# EAGLE design interface 2k20 (EAGLE 9.5.1)

## Sheet 1 of 3
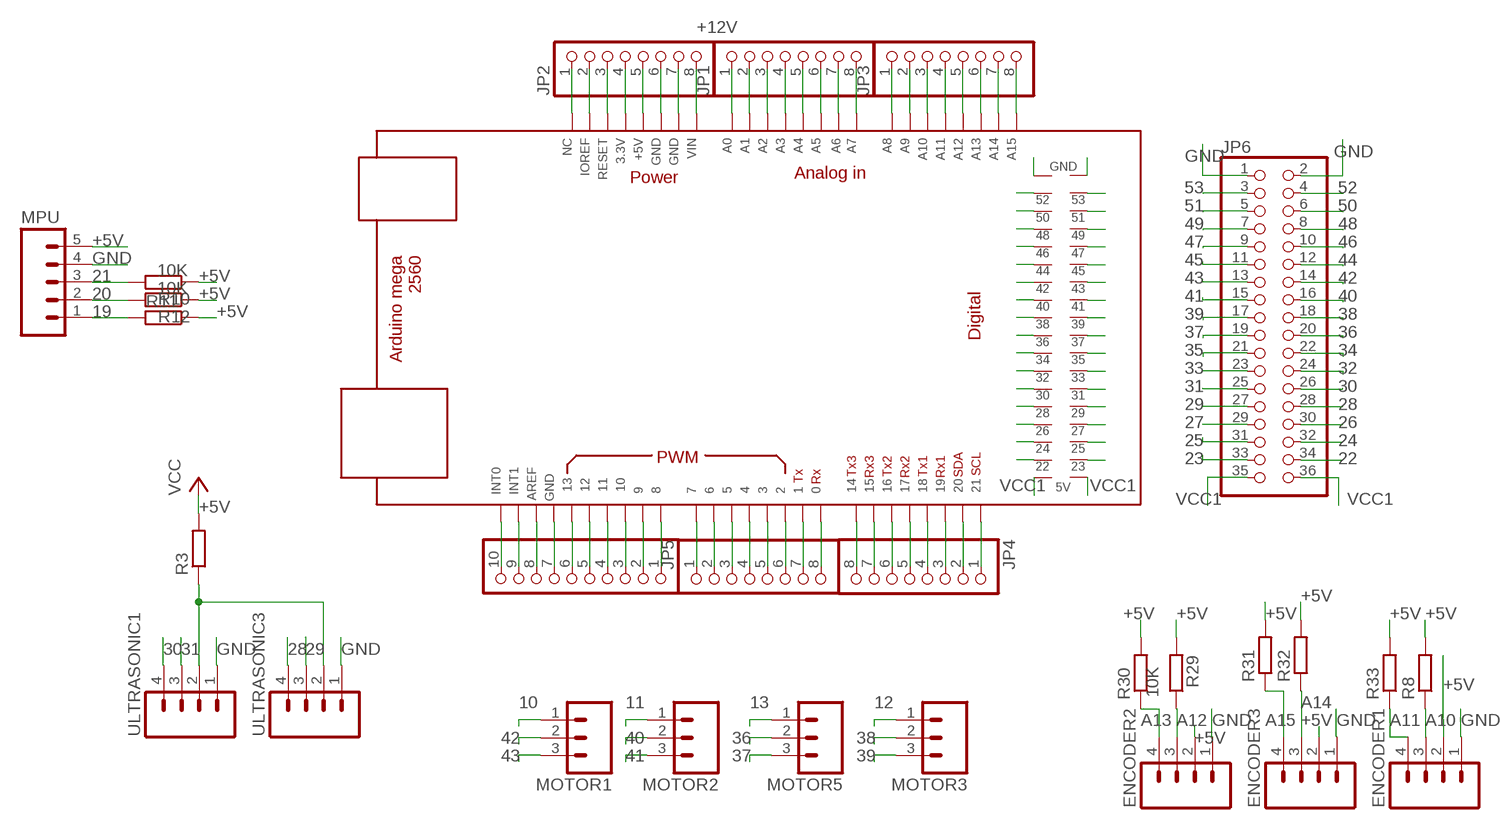
[diagram p0: schematic, sheet 1]

### Parts
ENCODER1  ULTRASONIC  M04POLAR  [MOLEX-1X4]
ENCODER2  ULTRASONIC  M04POLAR  [MOLEX-1X4]
ENCODER3  ULTRASONIC  M04POLAR  [MOLEX-1X4]
JP1  PINHD-1X8  [1X08]
JP2  PINHD-1X8  [1X08]
JP3  PINHD-1X8  [1X08]
JP4  PINHD-1X8  [1X08]
JP5  PINHD-1X8  [1X08]
JP6  PINHD-2X18  [2X18]
MOTOR1  M03POLAR  [MOLEX-1X3@1]
MOTOR2  M03POLAR  [MOLEX-1X3@1]
MOTOR3  M03POLAR  [MOLEX-1X3@1]
MOTOR5  M03POLAR  [MOLEX-1X3@1]
MPU  M05  [05P]
PWMH1  pwm  PINHD-1X10_ARD  [1X10]
R3  R-EU_M0805  [M0805]
R8  R-EU_M0805  [M0805]
R10  10K  R-EU_M0805  [M0805]
R11  R-EU_M0805  [M0805]
R12  10K  R-EU_M0805  [M0805]
R29  R-EU_M0805  [M0805]
R30  10K  R-EU_M0805  [M0805]
R31  R-EU_M0805  [M0805]
R32  R-EU_M0805  [M0805]
R33  R-EU_M0805  [M0805]
U$1  MEGA_DEVICE  [MEGABOX]
ULTRASONIC1  ULTRASONIC  M04POLAR  [MOLEX-1X4]
ULTRASONIC3  ULTRASONIC  M04POLAR  [MOLEX-1X4]

### Nets
0: JP5.8 U$1.0
1: JP5.7 U$1.1
2: JP5.6 U$1.2
3: JP5.5 U$1.3
3.3V: JP2.4 U$1.3V3
4: JP5.4 U$1.4
5: JP5.3 U$1.5
6: JP5.2 U$1.6
7: JP5.1 U$1.7
8: PWMH1.1 U$1.8
9: PWMH1.2 U$1.9
10: MOTOR1.1 PWMH1.3 U$1.10
11: MOTOR2.1 PWMH1.4 U$1.11
12: MOTOR3.1 PWMH1.5 U$1.12
13: MOTOR5.1 PWMH1.6 U$1.13
14: JP4.8 U$1.14
15: JP4.7 U$1.15
16: JP4.6 U$1.16
17: JP4.5 U$1.17
18: JP4.4 U$1.18
19: JP4.3 MPU.1 R11.2 U$1.19
20: JP4.2 MPU.2 R12.2 U$1.20
21: JP4.1 MPU.3 R10.2 U$1.21
22: JP6.34 U$1.22 ; also sheet 3
23: JP6.33 U$1.23 ; also sheet 3
24: JP6.32 U$1.24 ; also sheet 2
25: JP6.31 U$1.25 ; also sheet 2
26: JP6.30 U$1.26
27: JP6.29 U$1.27
28: JP6.28 U$1.28 ULTRASONIC3.4
29: JP6.27 U$1.29 ULTRASONIC3.3
30: JP6.26 U$1.30 ULTRASONIC1.4
31: JP6.25 U$1.31 ULTRASONIC1.3
32: JP6.24 U$1.32
33: JP6.23 U$1.33
34: JP6.22 U$1.34
35: JP6.21 U$1.35
36: JP6.20 MOTOR5.2 U$1.36
37: JP6.19 MOTOR5.3 U$1.37
38: JP6.18 MOTOR3.2 U$1.38
39: JP6.17 MOTOR3.3 U$1.39
40: JP6.16 MOTOR2.2 U$1.40
41: JP6.15 MOTOR2.3 U$1.41
42: JP6.14 MOTOR1.2 U$1.42
43: JP6.13 MOTOR1.3 U$1.43
44: JP6.12 U$1.44
45: JP6.11 U$1.45 ; also sheet 3
46: JP6.10 U$1.46 ; also sheet 3
47: JP6.9 U$1.47 ; also sheet 3
48: JP6.8 U$1.48 ; also sheet 3
49: JP6.7 U$1.49 ; also sheet 3
50: JP6.6 U$1.50 ; also sheet 2
51: JP6.5 U$1.51 ; also sheet 2
52: JP6.4 U$1.52 ; also sheet 2
53: JP6.3 U$1.53 ; also sheet 2
+5V: ENCODER1.2 ENCODER2.2 ENCODER3.2 MPU.5 R3.2 R8.2 R10.1 R11.1 R12.1 R29.2 R30.2 R31.2 R32.2 R33.2 ; supply symbol labelled VCC ; also sheet 2,3
+12V: JP2.8 U$1.VIN ; also sheet 2
A0: JP1.1 U$1.A0
A1: JP1.2 U$1.A1
A2: JP1.3 U$1.A2
A3: JP1.4 U$1.A3
A4: JP1.5 U$1.A4
A5: JP1.6 U$1.A5
A6: JP1.7 U$1.A6
A7: JP1.8 U$1.A7
A8: JP3.1 U$1.A8
A9: JP3.2 U$1.A9
A10: ENCODER1.3 JP3.3 R8.1 U$1.A10
A11: ENCODER1.4 JP3.4 R33.1 U$1.A11
A12: ENCODER2.3 JP3.5 R29.1 U$1.A12
A13: ENCODER2.4 JP3.6 R30.1 U$1.A13
A14: ENCODER3.3 JP3.7 R32.1 U$1.A14
A15: ENCODER3.4 JP3.8 R31.1 U$1.A15
AREF: PWMH1.8 U$1.AREF
GND: ENCODER1.1 ENCODER2.1 ENCODER3.1 JP2.6 JP2.7 JP6.1 JP6.2 MPU.4 PWMH1.7 U$1.GND@1(GND) U$1.GND@2(GND) U$1.GND@3(GND) U$1.GND@4(GND) U$1.GND@5(GND) ULTRASONIC1.1 ULTRASONIC3.1 ; also sheet 2,3
INT0: PWMH1.10 U$1.INT2
INT1: PWMH1.9 U$1.INT1
IOREF: JP2.2 U$1.IOREF
N$27: R3.1 ULTRASONIC1.2 ULTRASONIC3.2
NC: JP2.1 U$1.NC
RESET: JP2.3 U$1.RESET ; also sheet 3
VCC: JP2.5 U$1.5V ; also sheet 2
VCC1: JP6.35 JP6.36 U$1.5V@1(5V) U$1.5V@2(5V)

## Sheet 2 of 3
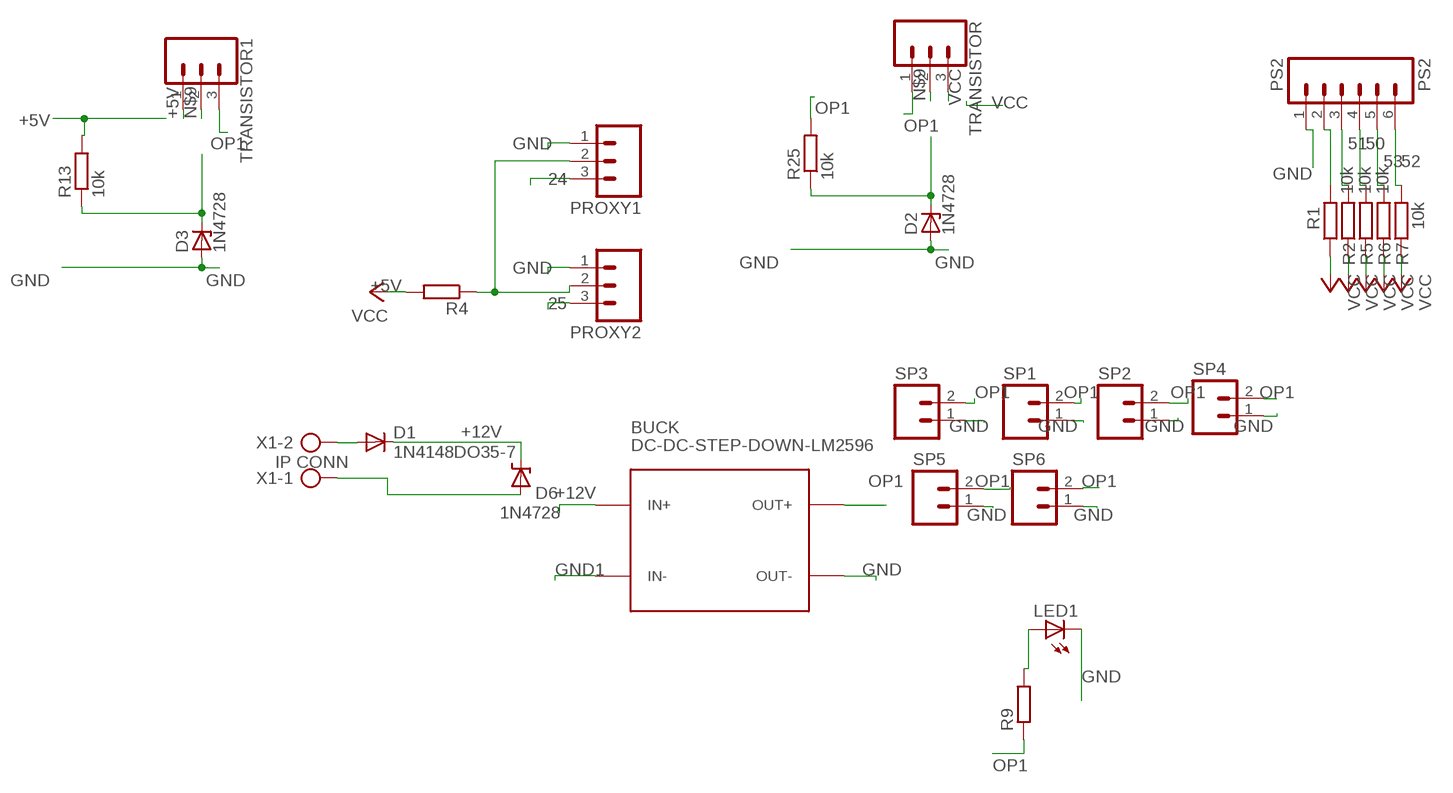
[diagram p1: schematic, sheet 2]

### Parts
BUCK  DC-DC-STEP-DOWN-LM2596  [DC-DC-STEP-DOWN-LM2596]
D1  1N4148DO35-7  [DO35-7]
D2  1N4728  [DO41Z10]
D3  1N4728  [DO41Z10]
D6  1N4728  [DO41Z10]
LED1  LEDCHIPLED_0805  [CHIPLED_0805]
PROXY1  M03POLAR  [MOLEX-1X3@1]
PROXY2  M03POLAR  [MOLEX-1X3@1]
PS2  PS2  M06POLAR  [MOLEX-1X6]
R1  R-EU_M0805  [M0805]
R2  10k  R-EU_M0805  [M0805]
R4  R-EU_M0805  [M0805]
R5  10k  R-EU_M0805  [M0805]
R6  10k  R-EU_M0805  [M0805]
R7  10k  R-EU_M0805  [M0805]
R9  500  R-EU_M0805  [M0805]
R13  10k  R-EU_M0805  [M0805]
R25  10k  R-EU_M0805  [M0805]
SP1  M02  [02P]
SP2  M02  [02P]
SP3  M02  [02P]
SP4  M02  [02P]
SP5  M02  [02P]
SP6  M02  [02P]
TRANSISTOR  CONN_03LOCK  [1X03_LOCK]
TRANSISTOR1  CONN_03LOCK  [1X03_LOCK]
X1  IP CONN  AK300/2  [AK300/2]

### Nets
24: PROXY1.3 ; also sheet 1
25: PROXY2.3 ; also sheet 1
50: PS2.4 R5.2 ; also sheet 1
51: PS2.3 R2.2 ; also sheet 1
52: PS2.6 R7.2 ; also sheet 1
53: PS2.5 R6.2 ; also sheet 1
+5V: R1.1 R2.1 R4.2 R5.1 R6.1 R7.1 R13.2 TRANSISTOR1.1 ; supply symbol labelled VCC ; also sheet 1,3
+12V: BUCK.IN+ D1.C D6.C ; also sheet 1
GND: BUCK.OUT- D2.A D3.A LED1.C PROXY1.1 PROXY2.1 PS2.1 SP1.1 SP2.1 SP3.1 SP4.1 SP5.1 SP6.1 ; also sheet 1,3
GND1: BUCK.IN- D6.A X1.1
N$1: LED1.A R9.2
N$3: D1.A X1.2
N$8: PROXY1.2 PROXY2.2 R4.1
N$9: D2.C D3.C R13.1 R25.1 TRANSISTOR1.2 TRANSISTOR.2
N$28: PS2.2 R1.2
OP1: BUCK.OUT+ R9.1 R25.2 SP1.2 SP2.2 SP3.2 SP4.2 SP5.2 SP6.2 TRANSISTOR1.3 TRANSISTOR.1
VCC: TRANSISTOR.3 ; also sheet 1

## Sheet 3 of 3
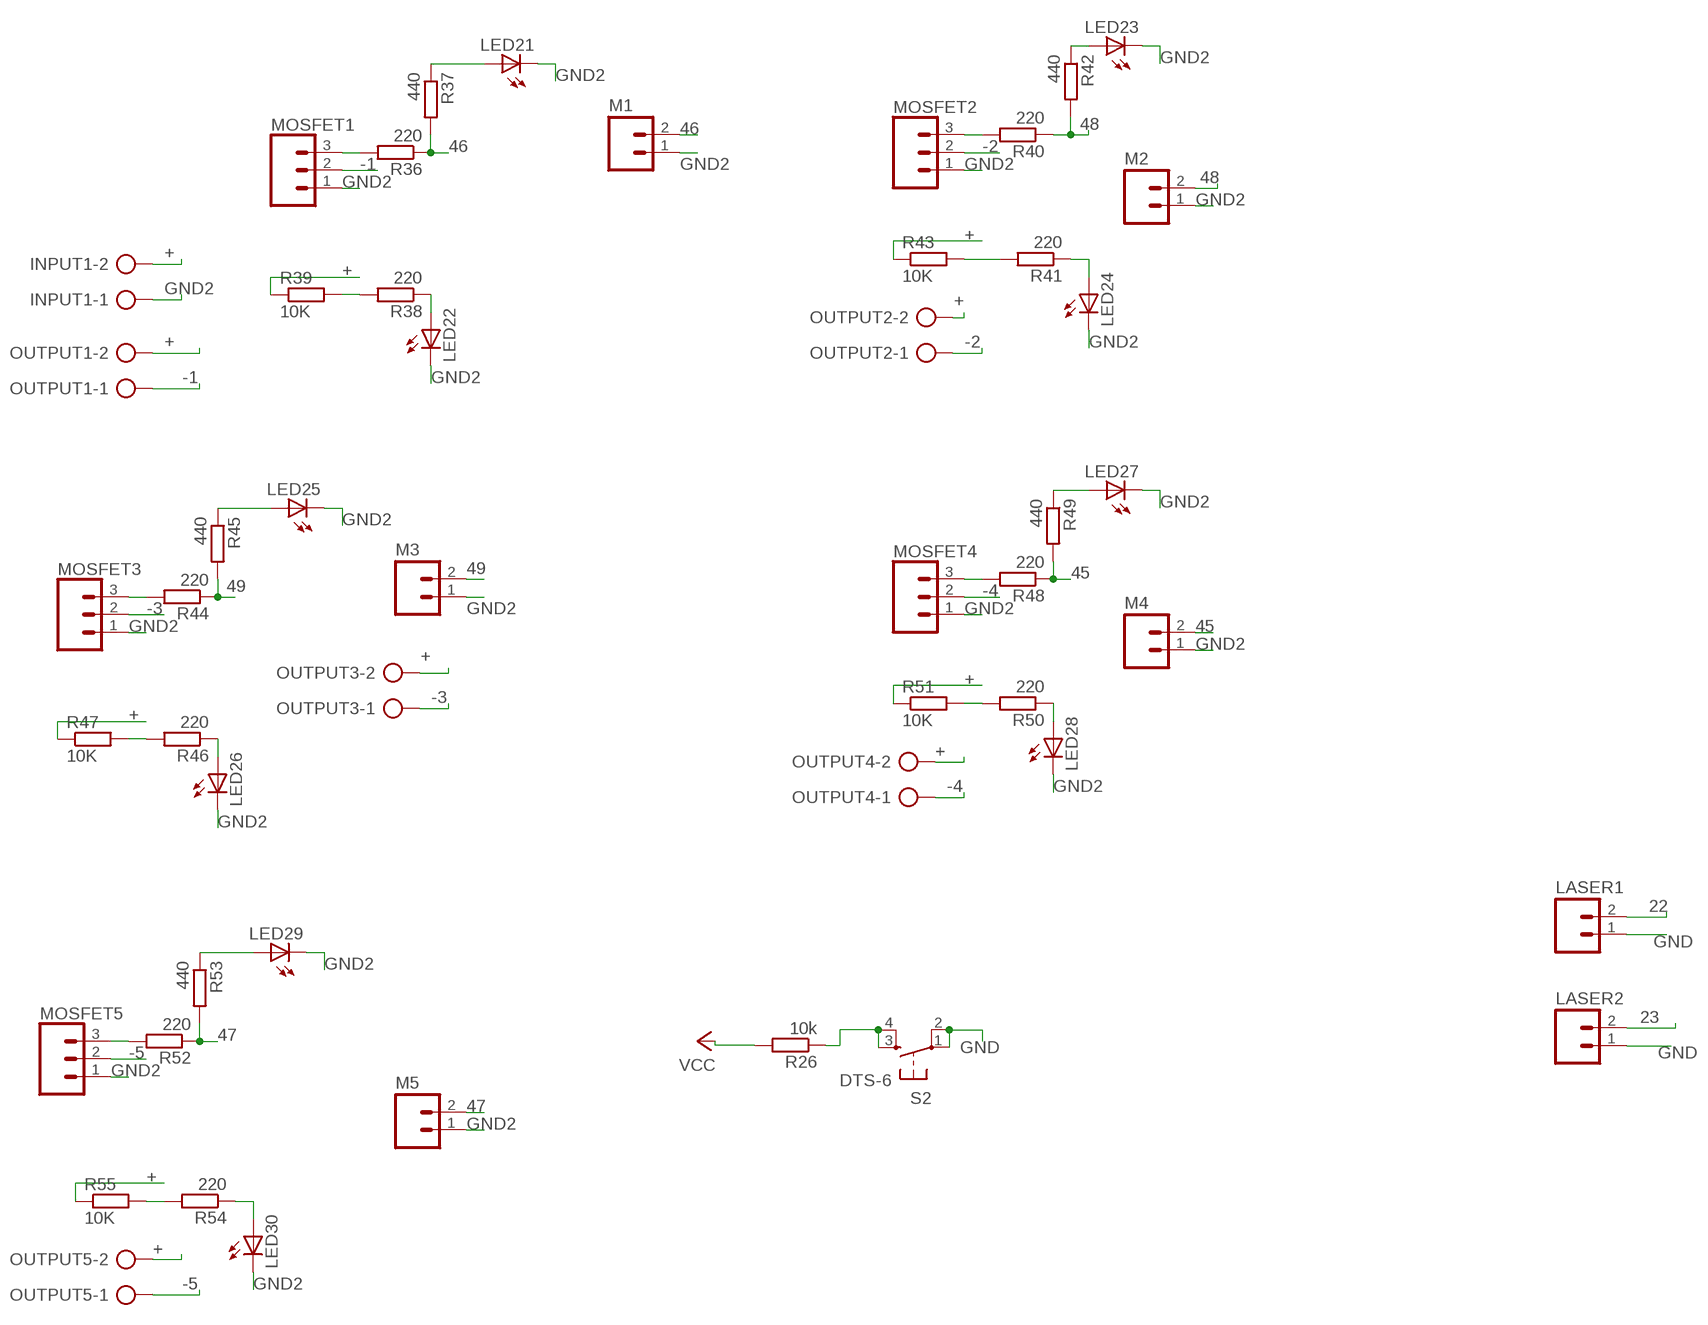
[diagram p2: schematic, sheet 3]

### Parts
INPUT1  AK300/2  [AK300/2]
LASER1  M02  [02P]
LASER2  M02  [02P]
LED21  LEDCHIPLED_0805  [CHIPLED_0805]
LED22  LEDCHIPLED_0805  [CHIPLED_0805]
LED23  LEDCHIPLED_0805  [CHIPLED_0805]
LED24  LEDCHIPLED_0805  [CHIPLED_0805]
LED25  LEDCHIPLED_0805  [CHIPLED_0805]
LED26  LEDCHIPLED_0805  [CHIPLED_0805]
LED27  LEDCHIPLED_0805  [CHIPLED_0805]
LED28  LEDCHIPLED_0805  [CHIPLED_0805]
LED29  LEDCHIPLED_0805  [CHIPLED_0805]
LED30  LEDCHIPLED_0805  [CHIPLED_0805]
M1  M02  [02P]
M2  M02  [02P]
M3  M02  [02P]
M4  M02  [02P]
M5  M02  [02P]
MOSFET1  CONN_03LOCK  [1X03_LOCK]
MOSFET2  CONN_03LOCK  [1X03_LOCK]
MOSFET3  CONN_03LOCK  [1X03_LOCK]
MOSFET4  CONN_03LOCK  [1X03_LOCK]
MOSFET5  CONN_03LOCK  [1X03_LOCK]
OUTPUT1  AK300/2  [AK300/2]
OUTPUT2  AK300/2  [AK300/2]
OUTPUT3  AK300/2  [AK300/2]
OUTPUT4  AK300/2  [AK300/2]
OUTPUT5  AK300/2  [AK300/2]
R26  10k  R-EU_M0805  [M0805]
R36  220  R-EU_M0805  [M0805]
R37  440  R-EU_M0805  [M0805]
R38  220  R-EU_M0805  [M0805]
R39  10K  R-EU_R0805  [R0805]
R40  220  R-EU_M0805  [M0805]
R41  220  R-EU_M0805  [M0805]
R42  440  R-EU_M0805  [M0805]
R43  10K  R-EU_R0805  [R0805]
R44  220  R-EU_M0805  [M0805]
R45  440  R-EU_M0805  [M0805]
R46  220  R-EU_M0805  [M0805]
R47  10K  R-EU_R0805  [R0805]
R48  220  R-EU_M0805  [M0805]
R49  440  R-EU_M0805  [M0805]
R50  220  R-EU_M0805  [M0805]
R51  10K  R-EU_R0805  [R0805]
R52  220  R-EU_M0805  [M0805]
R53  440  R-EU_M0805  [M0805]
R54  220  R-EU_M0805  [M0805]
R55  10K  R-EU_R0805  [R0805]
S2  DTS-6  [DTS-6]

### Nets
22: LASER1.2 ; also sheet 1
23: LASER2.2 ; also sheet 1
45: M4.2 R48.1 R49.2 ; also sheet 1
46: M1.2 R36.1 R37.2 ; also sheet 1
47: M5.2 R52.1 R53.2 ; also sheet 1
48: M2.2 R40.1 R42.2 ; also sheet 1
49: M3.2 R44.1 R45.2 ; also sheet 1
+: INPUT1.2 OUTPUT1.2 OUTPUT2.2 OUTPUT3.2 OUTPUT4.2 OUTPUT5.2 R39.1 R43.1 R47.1 R51.1 R55.1
+5V: R26.2 ; supply symbol labelled VCC ; also sheet 1,2
-1: MOSFET1.2 OUTPUT1.1
-2: MOSFET2.2 OUTPUT2.1
-3: MOSFET3.2 OUTPUT3.1
-4: MOSFET4.2 OUTPUT4.1
-5: MOSFET5.2 OUTPUT5.1
GND: LASER1.1 LASER2.1 S2.1 S2.2 ; also sheet 1,2
GND2: INPUT1.1 LED21.C LED22.C LED23.C LED24.C LED25.C LED26.C LED27.C LED28.C LED29.C LED30.C M1.1 M2.1 M3.1 M4.1 M5.1 MOSFET1.1 MOSFET2.1 MOSFET3.1 MOSFET4.1 MOSFET5.1
N$41: MOSFET1.3 R36.2
N$42: LED21.A R37.1
N$43: LED22.A R38.1
N$44: R38.2 R39.2
N$45: MOSFET2.3 R40.2
N$46: LED23.A R42.1
N$47: R41.2 R43.2
N$48: LED24.A R41.1
N$49: MOSFET3.3 R44.2
N$50: LED25.A R45.1
N$51: LED26.A R46.1
N$52: R46.2 R47.2
N$53: MOSFET4.3 R48.2
N$54: LED27.A R49.1
N$55: LED28.A R50.1
N$56: R50.2 R51.2
N$57: LED29.A R53.1
N$58: MOSFET5.3 R52.2
N$59: R54.2 R55.2
N$60: LED30.A R54.1
RESET: R26.1 S2.3 S2.4 ; also sheet 1

## Library data of the parts
BUCK = diy-modules:DC-DC-STEP-DOWN-LM2596: DC/DC Step-Down Regulator based on LM2596-ADJ chip LM2596 datasheet available here: http://www.ti.com/lit/ds/symlink/lm2596.pdf Click here to find device on ebay.com <http://www.ebay.com/sch/lm2596+power+regulator>
D1 = diode:1N4148: DIODE high speed (Philips)
D2 D3 D6 = diode:1N4728: Z DIODE 3.3 V, 1W, 5 percent
ENCODER1-ENCODER3 ULTRASONIC1 ULTRASONIC3 = SparkFun-Connectors:M04: Header 4 Standard 4-pin 0.1" header. Use with straight break away headers (SKU : PRT-00116), right angle break away headers (PRT-00553), swiss pins (PRT-00743), machine pins (PRT-00117), and female headers (PRT-00115). Molex polarized connector foot print use with SKU : PRT-08231 with associated crimp pins and housings. 1MM SMD Version SKU: PRT-10208
INPUT1 OUTPUT2-OUTPUT5 X1 = con-ptr500:AK300/2: CONNECTOR; OC_FARNELL: unknown; OC_NEWARK: unknown
JP1-JP5 = pinhead:PINHD-1X8: PIN HEADER
JP6 = pinhead:PINHD-2X18: PIN HEADER
LASER1 LASER2 M1-M5 SP1-SP6 = con-amp-quick:M02: AMP QUICK CONNECTOR; OC_FARNELL: unknown; OC_NEWARK: unknown
LED1 LED21-LED30 = led:LED: LED OSRAM: - CHIPLED LG R971, LG N971, LY N971, LG Q971, LY Q971, LO R971, LY R971 LH N974, LH R974 LS Q976, LO Q976, LY Q976 LO Q996 - Hyper CHIPLED LW Q18S LB Q993, LB Q99A, LB R99A - SideLED LS A670, LO A670, LY A670, LG A670, LP A670 LB A673, LV A673, LT A673, LW A673 LH A674 LY A675 LS A676, LA A676, LO A676, LY A676, LW A676 LS A679, LY A679, LG A679 - Hyper Micro SIDELED® LS Y876, LA Y876, LO Y876, LY Y876 LT Y87S - SmartLED LW L88C, LW L88S LB L89C, LB L89S, LG L890 LS L89K, LO L89K, LY L89K LS L896, LA L896, LO L896, LY L896 - TOPLED LS T670, LO T670, LY T670, LG T670, LP T670 LSG T670, LSP T670, LSY T670, LOP T670, LYG T670 LG T671, LOG T671, LSG T671 LB T673, LV T673, LT T673, LW T673 LH T674 LS T676, LA T676, LO T676, LY T676, LB T676, LH T676, LSB T676, LW T676 LB T67C, LV T67C, LT T67C, LS T67K, LO T67K, LY T67K, LW E67C LS E67B, LA E67B, LO E67B, LY E67B, LB E67C, LV E67C, LT E67C LW T67C LS T679, LY T679, LG T679 LS T770, LO T770, LY T770, LG T770, LP T770 LB T773, LV T773, LT T773, LW T773 LH T774 LS E675, LA E675, LY E675, LS T675 LS T776, LA T776, LO T776, LY T776, LB T776 LHGB T686 LT T68C, LB T68C - Hyper Mini TOPLED® LB M676 - Mini TOPLED Santana® LG M470 LS M47K, LO M47K, LY M47K Source: http://www.osram.convergy.de LUXEON: - LUMILED® LXK2-PW12-R00, LXK2-PW12-S00, LXK2-PW14-U00, LXK2-PW14-V00 LXK2-PM12-R00, LXK2-PM12-S00, LXK2-PM14-U00 LXK2-PE12-Q00, LXK2-PE12-R00, LXK2-PE12-S00, LXK2-PE14-T00, LXK2-PE14-U00 LXK2-PB12-K00, LXK2-PB12-L00, LXK2-PB12-M00, LXK2-PB14-N00, LXK2-PB14-P00, LXK2-PB14-Q00 LXK2-PR12-L00, LXK2-PR12-M00, LXK2-PR14-Q00, LXK2-PR14-R00 LXK2-PD12-Q00, LXK2-PD12-R00, LXK2-PD12-S00 LXK2-PH12-R00, LXK2-PH12-S00 LXK2-PL12-P00, LXK2-PL12-Q00, LXK2-PL12-R00 Source: www.luxeon.com KINGBRIGHT: KA-3528ASYC Source: www.kingbright.com
MOSFET1-MOSFET5 TRANSISTOR TRANSISTOR1 = SparkFun-Connectors:CONN_03: Multi connection point. Often used as Generic Header-pin footprint for 0.1 inch spaced/style header connections On any of the 0.1 inch spaced packages, you can populate with these: Break Away Headers - Straight <https://www.sparkfun.com/products/116> (PRT-00116) Break Away Male Headers - Right Angle <https://www.sparkfun.com/products/553> (PRT-00553) Female Headers <https://www.sparkfun.com/products/115> (PRT-00115) Break Away Headers - Machine Pin <https://www.sparkfun.com/products/117> (PRT-00117) Break Away Female Headers - Swiss Machine Pin <https://www.sparkfun.com/products/743> (PRT-00743) Stackable Header - 3 Pin (Female, 0.1") <https://www.sparkfun.com/products/13875> (PRT-13875) For SCREWTERMINALS and SPRING TERMINALS visit here: Screw Terimnals on SparkFun.com <https://www.sparkfun.com/search/results?term=Screw+Terminals> (5mm/3.5mm/2.54mm spacing) This device is also useful as a general connection point to wire up your design to another part of your project. Our various solder wires solder well into these plated through hole pads. Hook-Up Wire - Assortment (Stranded, 22 AWG) <https://www.sparkfun.com/products/11375> (PRT-11375) Hook-Up Wire - Assortment (Solid Core, 22 AWG) <https://www.sparkfun.com/products/11367> (PRT-11367) View the entire wire category on our website here <https://www.sparkfun.com/categories/141> Special notes: Molex polarized connector foot print use with SKU : PRT-08232 with associated crimp pins and housings.
MOTOR1-MOTOR3 MOTOR5 PROXY1 PROXY2 = SparkFun-Connectors:M03: Header 3 Standard 3-pin 0.1" header. Use with straight break away headers (SKU : PRT-00116), right angle break away headers (PRT-00553), swiss pins (PRT-00743), machine pins (PRT-00117), and female headers (PRT-00115). Molex polarized connector foot print use with SKU : PRT-08232 with associated crimp pins and housings.
MPU = con-amp-quick:M05: AMP QUICK CONNECTOR; OC_FARNELL: unknown; OC_NEWARK: unknown
OUTPUT1 = con-ptr500:AK300/2: CONNECTOR; OC_FARNELL: unknown; OC_NEWARK: unknown; SPICEPREFIX: X
PS2 = SparkFun-Connectors:M06: Header 6 Standard 6-pin 0.1" header. Use with straight break away headers (SKU : PRT-00116), right angle break away headers (PRT-00553), swiss pins (PRT-00743), machine pins (PRT-00117), and female headers (PRT-00115). Molex polarized connector foot print use with SKU : PRT-08094 with associated crimp pins and housings. NOTES ON THE VARIANTS LOCK and LOCK_LONGPADS... This footprint was designed to help hold the alignment of a through-hole component (i.e. 6-pin header) while soldering it into place. You may notice that each hole has been shifted either up or down by 0.005 of an inch from it's more standard position (which is a perfectly straight line). This slight alteration caused the pins (the squares in the middle) to touch the edges of the holes. Because they are alternating, it causes a "brace" to hold the component in place. 0.005 has proven to be the perfect amount of "off-center" position when using our standard breakaway headers. Although looks a little odd when you look at the bare footprint, once you have a header in there, the alteration is very hard to notice. Also,if you push a header all the way into place, it is covered up entirely on the bottom side. This idea of altering the position of holes to aid alignment will be further integrated into the Sparkfun Library for other footprints. It can help hold any component with 3 or more connection pins.
PWMH1 = SmartPrj:PINHD-1X10_ARD: PIN HEADER
R1-R13 R25 R26 R29-R33 R36-R38 R40-R42 R44-R46 R48-R50 R52-R54 = resistor:R-EU_: RESISTOR, European symbol
R39 R43 R47 R51 R55 = rcl:R-EU_: RESISTOR, European symbol; SPICEPREFIX: R
S2 = switch-tact:DTS-6
U$1 = ArduinoMegaSymbol:MEGA_DEVICE: mega card as device

## Board
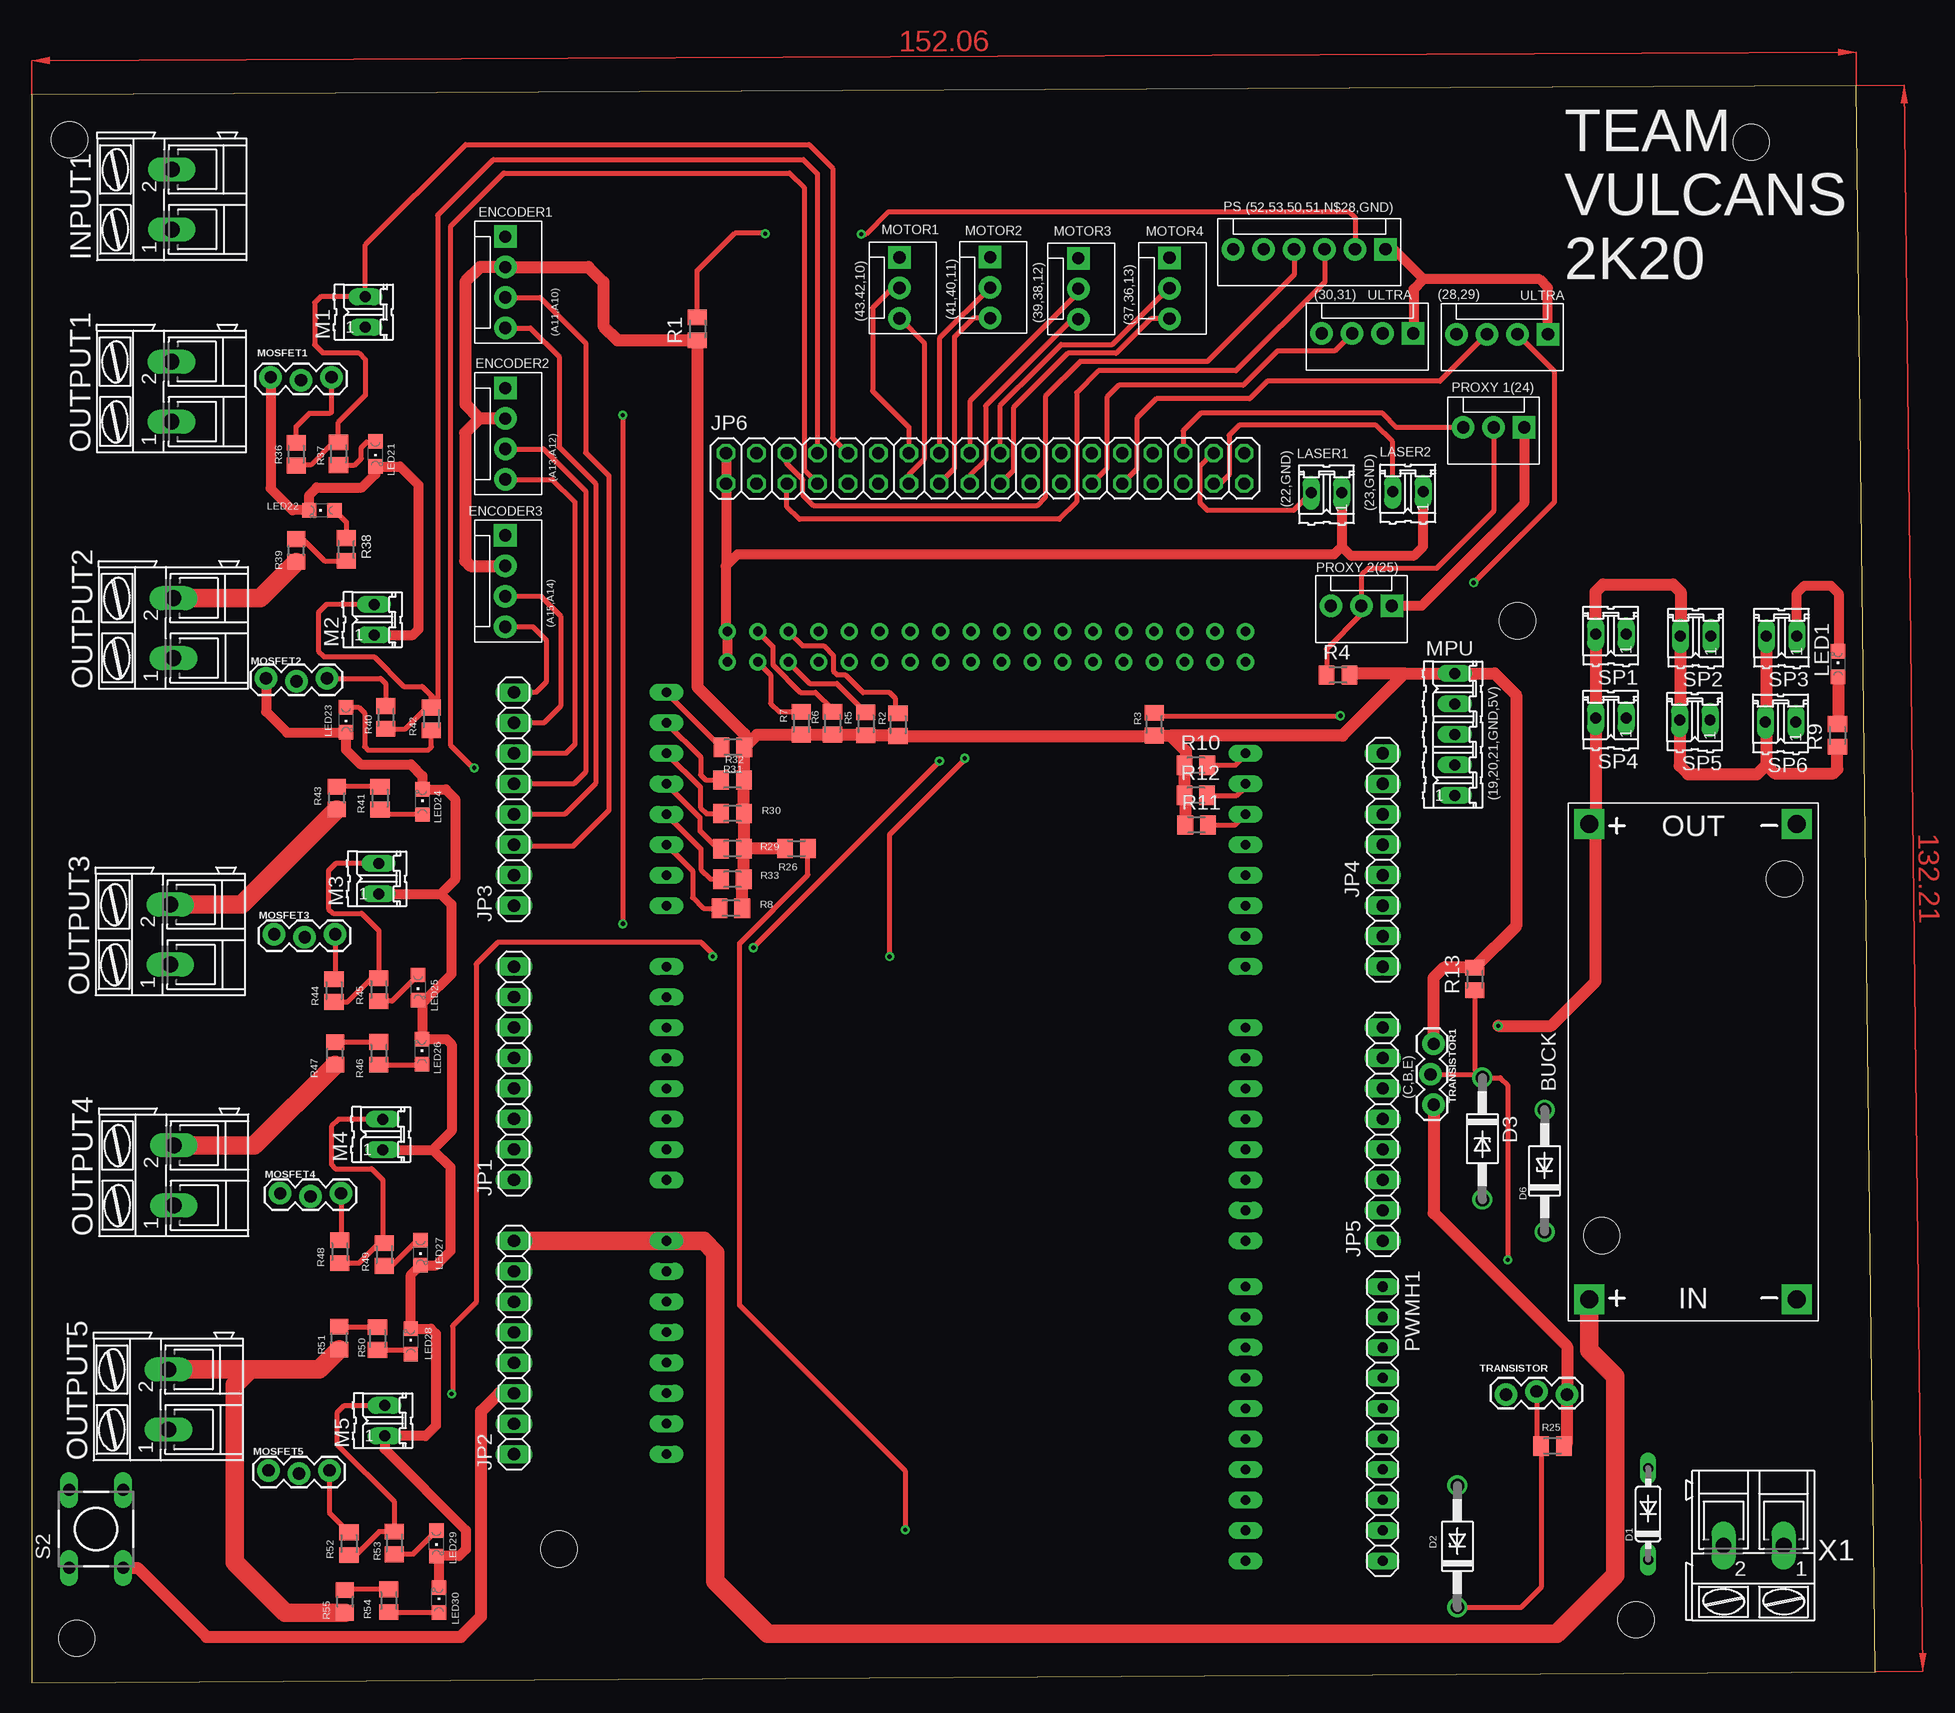
[diagram p3: board, top side]
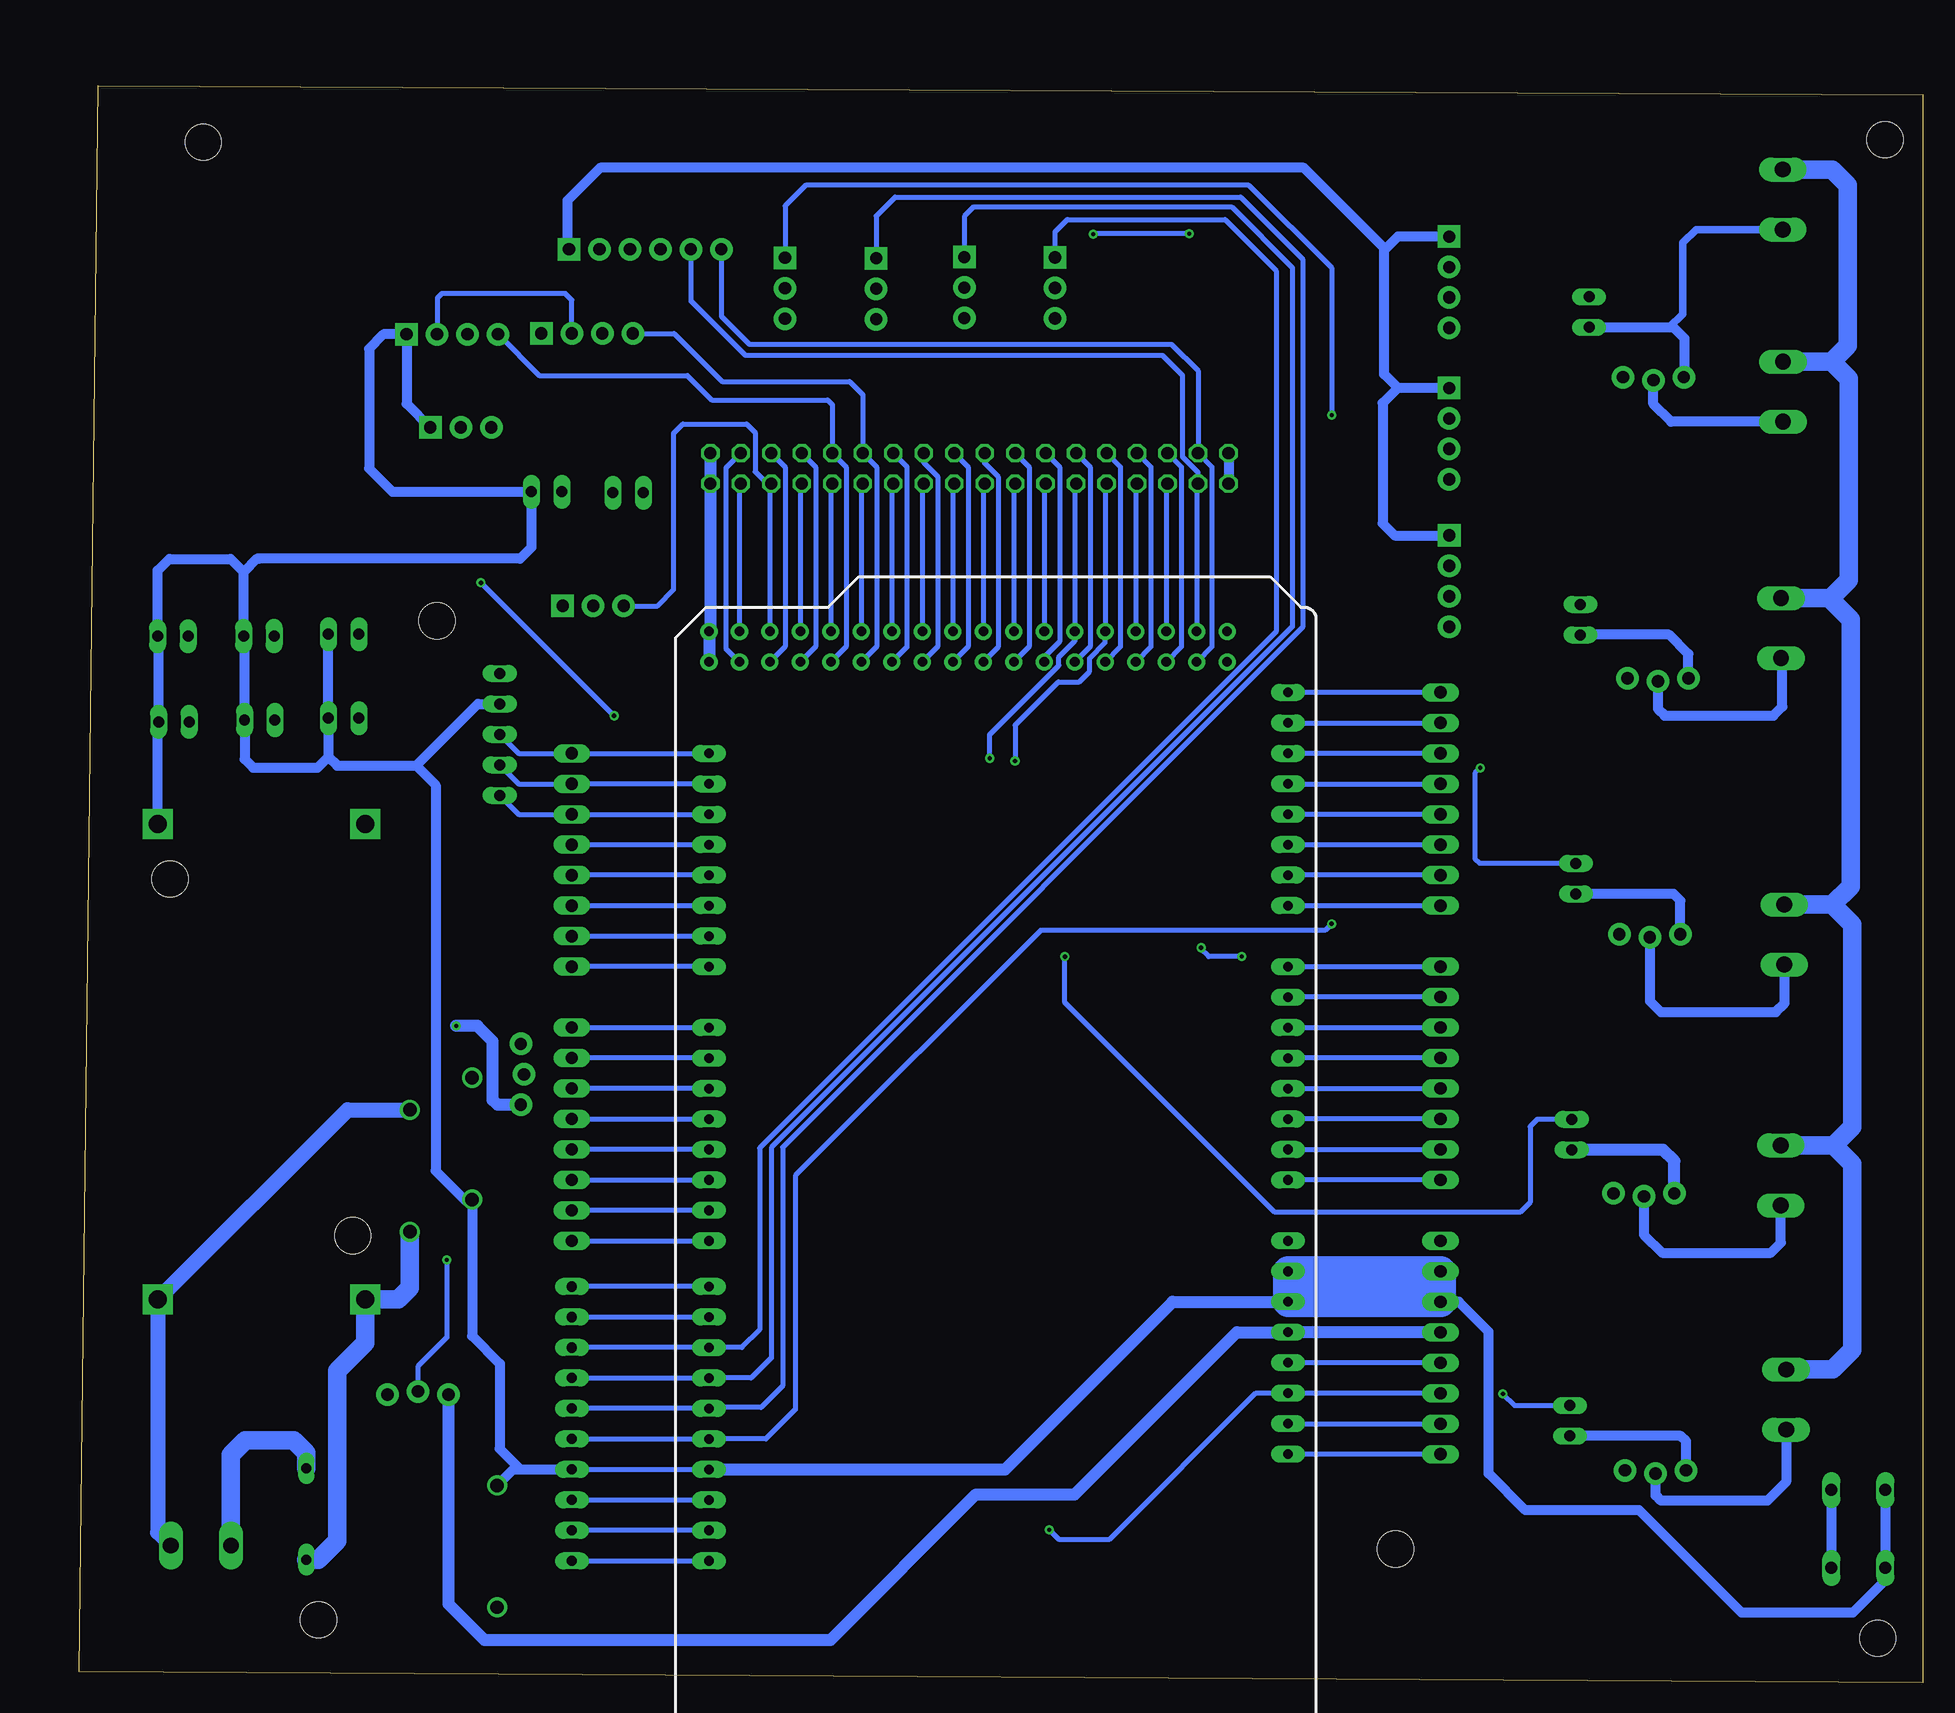
[diagram p4: board, bottom side, seen from below]

Size 153.62 x 133.11 mm. Coordinates in mm from the lower left corner, seen from the top.
Outline: 0.02,0 153.62,0.91 152.05,133.11 0,132.39 0.02,0
Copper layers (1*16): Top 0.035mm / dielectric 1.5mm / Bottom 0.035mm
Design rules "default": minimum track width 6mil, minimum drill 0.35mm, track to track 6mil, track to pad 6mil, pad to pad 6mil, via to via 6mil, smd to smd 6mil, copper to edge 40mil, drill to drill 6mil, minimum pad ring 10mil, minimum via ring 8mil, stop-mask expansion 4mil, vias tented up to drill 0mil, thermal gap 10mil
Holes 3 mm at 143.29,128.41 133.69,5.25 3.76,3.71 3.16,128.63 43.95,11.15 123.81,88.51

### Footprints (pad centres in the part's own frame; a part is rotated, then mirrored left to right if it is on the bottom)
DC-DC-STEP-DOWN-LM2596 = drill 1.5 pad 2.5 square: IN+ -19.812,8.636; IN- -19.812,-8.636; OUT+ 19.812,8.636; OUT- 19.812,-8.636 | hole 3: -14.478,7.62; 15.24,-7.62
DO35-7 = drill 0.813 long: A 3.81,0; C -3.81,0
DO41Z10 = drill 1.118: A 5.08,0; C -5.08,0
MOLEX-1X4 = drill 1.016 pad 1.88 square: 1 0,0 | drill 1.016 pad 1.88: 2 2.54,0; 3 5.08,0; 4 7.62,0
AK300/2 = drill 1.321 long: 1 -2.515,0; 2 2.489,0
1X08 = drill 1.016 long: 1 -8.89,0; 2 -6.35,0; 3 -3.81,0; 4 -1.27,0; 5 1.27,0; 6 3.81,0; 7 6.35,0; 8 8.89,0
2X18 = drill 1.016 octagon: 1 -21.59,-1.27; 2 -21.59,1.27; 3 -19.05,-1.27; 4 -19.05,1.27; 5 -16.51,-1.27; 6 -16.51,1.27; 7 -13.97,-1.27; 8 -13.97,1.27; 9 -11.43,-1.27; 10 -11.43,1.27; 11 -8.89,-1.27; 12 -8.89,1.27; 13 -6.35,-1.27; 14 -6.35,1.27; 15 -3.81,-1.27; 16 -3.81,1.27; 17 -1.27,-1.27; 18 -1.27,1.27; 19 1.27,-1.27; 20 1.27,1.27; 21 3.81,-1.27; 22 3.81,1.27; 23 6.35,-1.27; 24 6.35,1.27; 25 8.89,-1.27; 26 8.89,1.27; 27 11.43,-1.27; 28 11.43,1.27; 29 13.97,-1.27; 30 13.97,1.27; 31 16.51,-1.27; 32 16.51,1.27; 33 19.05,-1.27; 34 19.05,1.27; 35 21.59,-1.27; 36 21.59,1.27
02P = drill 0.914 long: 1 -1.27,0; 2 1.27,0
CHIPLED_0805 = smd 1.2 x 1.2: A 0,-1.05; C 0,1.05
1X03_LOCK = drill 1.016 pad 1.88: 1 0,0.127; 2 2.54,-0.127; 3 5.08,0.127
MOLEX-1X3@1 = drill 1.016 pad 1.88 square: 1 0,0 | drill 1.016 pad 1.88: 2 2.54,0; 3 5.08,0
05P = drill 0.914 long: 1 -5.08,0; 2 -2.54,0; 3 0,0; 4 2.54,0; 5 5.08,0
MOLEX-1X6 = drill 1.016 pad 1.88 square: 1 0,0 | drill 1.016 pad 1.88: 2 2.54,0; 3 5.08,0; 4 7.62,0; 5 10.16,0; 6 12.7,0
1X10 = drill 0.85 pad 1.422 long: 1 -11.43,0; 2 -8.89,0; 3 -6.35,0; 4 -3.81,0; 5 -1.27,0; 6 1.27,0; 7 3.81,0; 8 6.35,0; 9 8.89,0; 10 11.43,0
M0805 = smd 1.3 x 1.6: 1 -0.95,0; 2 0.95,0
R0805 = smd 1.3 x 1.5: 1 -0.95,0; 2 0.95,0
DTS-6 = drill 1 long: 1 -3.25,2.25; 2 3.25,2.25; 3 -3.25,-2.25; 4 3.25,-2.25
MEGABOX = drill 0.8 pad 1.422 long: 0 12.7,24.13; 1 10.16,24.13; 2 7.62,24.13; 3 5.08,24.13; 3V3 -15.24,-24.13; 4 2.54,24.13; 5 0,24.13; 5V -12.7,-24.13; 6 -2.54,24.13; 7 -5.08,24.13; 8 -8.89,24.13; 9 -11.43,24.13; 10 -13.97,24.13; 11 -16.51,24.13; 12 -19.05,24.13; 13 -21.59,24.13; 14 17.78,24.13; 15 20.32,24.13; 16 22.86,24.13; 17 25.4,24.13; 18 27.94,24.13; 19 30.48,24.13; 20 33.02,24.13; 21 35.56,24.13; A0 0,-24.13; A1 2.54,-24.13; A2 5.08,-24.13; A3 7.62,-24.13; A4 10.16,-24.13; A5 12.7,-24.13; A6 15.24,-24.13; A7 17.78,-24.13; A8 22.86,-24.13; A9 25.4,-24.13; A10 27.94,-24.13; A11 30.48,-24.13; A12 33.02,-24.13; A13 35.56,-24.13; A14 38.1,-24.13; A15 40.64,-24.13; AREF -26.67,24.13; GND@1 -24.13,24.13; GND@2 -10.16,-24.13; GND@3 -7.62,-24.13; INT1 -29.21,24.13; INT2 -31.75,24.13; IOREF -20.32,-24.13; NC -22.86,-24.13; RESET -17.78,-24.13; VIN -5.08,-24.13 | drill 0.8 pad 1.422: 5V@1 45.72,24.13; 5V@2 43.18,24.13; 22 43.18,21.59; 23 45.72,21.59; 24 43.18,19.05; 25 45.72,19.05; 26 43.18,16.51; 27 45.72,16.51; 28 43.18,13.97; 29 45.72,13.97; 30 43.18,11.43; 31 45.72,11.43; 32 43.18,8.89; 33 45.72,8.89; 34 43.18,6.35; 35 45.72,6.35; 36 43.18,3.81; 37 45.72,3.81; 38 43.18,1.27; 39 45.72,1.27; 40 43.18,-1.27; 41 45.72,-1.27; 42 43.18,-3.81; 43 45.72,-3.81; 44 43.18,-6.35; 45 45.72,-6.35; 46 43.18,-8.89; 47 45.72,-8.89; 48 43.18,-11.43; 49 45.72,-11.43; 50 43.18,-13.97; 51 45.72,-13.97; 52 43.18,-16.51; 53 45.72,-16.51; GND@4 43.18,-19.05; GND@5 45.72,-19.05

### Placement (x,y rotation side)
BUCK  138.45,51.75 90 top
D1  134.7,14.07 90 top
D2  118.8,11.37 90 top
D3  120.88,45.35 270 top
D6  126.07,42.68 90 top
ENCODER1  39.47,120.55 270 top
ENCODER2  39.47,107.93 270 top
ENCODER3  39.46,95.64 270 top
INPUT1  11.68,123.65 90 top
JP1  40.19,50.8 90 top
JP2  40.19,27.94 90 top
JP3  40.19,73.66 90 top
JP4  112.58,68.58 270 top
JP5  112.58,45.72 90 top
JP6  79.45,101.23 0 top
LASER1  107.9,99.2 180 top
LASER2  114.68,99.27 180 top
LED1  150.53,84.91 0 top
LED21  28.64,102.43 180 top
LED22  24.18,97.73 90 top
LED23  26.18,80.27 180 top
LED24  32.56,73.42 0 top
LED25  32.2,57.95 180 top
LED26  32.52,52.6 0 top
LED27  32.39,35.85 180 top
LED28  31.59,28.45 0 top
LED29  33.72,11.62 180 top
LED30  33.93,6.9 0 top
M1  27.81,114.26 90 top
M2  28.54,88.61 90 top
M3  28.92,67.02 90 top
M4  29.25,45.7 90 top
M5  29.41,21.85 90 top
MOSFET1  19.91,108.7 0 top
MOSFET2  19.53,83.6 0 top
MOSFET3  20.21,62.26 0 top
MOSFET4  20.7,40.67 0 top
MOSFET5  19.73,17.57 0 top
MOTOR1  72.32,118.82 270 top
MOTOR2  79.87,118.84 270 top
MOTOR3  87.22,118.74 270 top
MOTOR5  94.81,118.78 270 top
MPU  118.58,79.05 90 top
OUTPUT1  11.65,107.63 90 top
OUTPUT2  11.81,87.92 90 top
OUTPUT3  11.55,62.38 90 top
OUTPUT4  11.83,42.3 90 top
OUTPUT5  11.39,23.62 90 top
PROXY1  124.37,104.64 180 top
PROXY2  113.34,89.77 180 top
PS2  112.82,119.49 180 top
PWMH1  112.58,21.59 270 top
R1  55.47,112.85 90 top
R2  72.19,79.87 90 top
R3  93.53,79.91 270 top
R4  108.86,84.01 0 top
R5  69.51,79.93 90 top
R6  66.73,79.99 90 top
R7  64.13,79.99 90 top
R8  58.26,64.56 0 top
R9  150.47,78.96 90 top
R10  97.01,76.47 0 top
R11  97.08,71.5 0 top
R12  97.01,73.97 0 top
R13  120.25,58.66 90 top
R25  126.73,19.73 0 top
R26  63.74,69.53 180 top
R29  58.4,69.52 0 top
R30  58.39,72.46 0 top
R31  58.43,77.97 0 top
R32  58.4,75.25 0 top
R33  58.39,66.98 0 top
R36  22.03,102.41 90 top
R37  25.56,102.45 90 top
R38  26.21,94.46 270 top
R39  22.05,94.38 90 top
R40  29.5,80.46 90 top
R41  29.03,73.74 90 top
R42  33.29,80.34 90 top
R43  25.42,73.75 90 top
R44  25.2,57.7 90 top
R45  28.92,57.78 90 top
R46  28.91,52.46 90 top
R47  25.27,52.46 90 top
R48  25.67,35.93 90 top
R49  29.38,35.7 90 top
R50  28.82,28.7 90 top
R51  25.63,28.74 90 top
R52  26.44,11.59 90 top
R53  30.2,11.66 90 top
R54  29.75,6.84 90 top
R55  26.1,6.78 90 top
S2  5.36,12.82 90 top
SP1  131.59,87.4 180 top
SP2  138.66,87.25 180 top
SP3  145.82,87.25 180 top
SP4  131.59,80.41 180 top
SP5  138.59,80.25 180 top
SP6  145.74,80.09 180 top
TRANSISTOR  127.94,24.15 180 top
TRANSISTOR1  116.7,53.26 270 top
U$1  77.02,41.91 90 bottom
ULTRASONIC1  115.12,112.47 180 top
ULTRASONIC3  126.35,112.4 180 top
X1  143.48,11.44 180 top

### Tracks (layer width: path | path; a pad name or v marks a point on that pad's centre or on a via)
0
  Bottom 0.406: JP5.8 U$1.0
1
  Bottom 0.406: U$1.1 JP5.7
2
  Bottom 0.406: U$1.2 JP5.6
3
  Bottom 0.406: JP5.5 U$1.3
3.3V
  Bottom 0.406: JP2.4 U$1.3V3
4
  Bottom 0.406: U$1.4 JP5.4
5
  Bottom 0.406: JP5.3 U$1.5
6
  Bottom 0.406: U$1.6 JP5.2
7
  Bottom 0.406: JP5.1 U$1.7
8
  Bottom 0.406: U$1.8 PWMH1.1
9
  Bottom 0.406: PWMH1.2 U$1.9
10
  Bottom 0.406: PWMH1.3 U$1.10 98.41,27.94 96.92,29.43 96.92,44.57 53.88,87.61 53.88,117.7 58.14,121.96 71.29,121.96 72.32,120.93 MOTOR1.1
11
  Bottom 0.406: PWMH1.4 U$1.11 97.63,25.4 95.96,27.08 95.96,44.6 52.53,88.03 52.53,117.95 57.6,123.03 79.08,123.03 79.87,122.24 MOTOR2.1
12
  Bottom 0.406: PWMH1.5 U$1.12 101.07,22.94 96.81,22.94 95.02,24.73 95.02,44.64 51.68,87.98 51.68,118.68 56.84,123.84 85.63,123.84 87.22,122.26 MOTOR3.1
13  (via drill 0.35)
  Top 0.406: v49.26,105.67 v49.26,63.27 v49.27,63.26
  Bottom 0.406: PWMH1.6 U$1.13 96.41,20.32 93.95,22.78 93.95,42.29 73.51,62.72 49.81,62.72 v49.27,63.26 | v49.26,105.67 49.26,117.94 56.15,124.83 93.1,124.83 94.81,123.12 MOTOR5.1
14
  Bottom 0.406: U$1.14 JP4.8
15
  Bottom 0.406: JP4.7 U$1.15
16
  Bottom 0.406: JP4.6 U$1.16
17
  Bottom 0.406: U$1.17 JP4.5
18
  Bottom 0.406: JP4.4 U$1.18
19
  Top 0.406: R11.2 100.25,71.5 U$1.19
  Bottom 0.406: U$1.19 JP4.3 117.01,72.39 MPU.1
20
  Top 0.406: R12.2 100.44,73.97 101.15,74.68 U$1.20
  Bottom 0.406: U$1.20 JP4.2 117.01,74.93 MPU.2
21
  Top 0.406: R10.2 100.3,76.48 101.15,77.33 U$1.21
  Bottom 0.406: U$1.21 JP4.1 117.01,77.47 MPU.3
22
  Top 0.406: LASER1.2 105.14,97.72 97.98,97.72 97.36,98.34 97.36,101.43 98.42,102.5 JP6.34
  Bottom 0.406: JP6.34 99.73,101.26 99.73,86.22 U$1.22
23
  Top 0.406: LASER2.2 113.41,103.44 112.02,104.82 100.61,104.82 99.78,103.99 99.78,100.7 99.04,99.96 JP6.33
  Bottom 0.406: JP6.33 98.61,99.84 U$1.23
24
  Top 0.406: PROXY1.3 113.74,104.64 112.57,105.82 97.4,105.82 95.96,104.37 JP6.32
  Bottom 0.406: JP6.32 94.8,101.34 94.8,86.36 U$1.24 | U$1.24
25
  Bottom 0.406: U$1.25 96.07,99.84 JP6.31 96.31,99.96 97.3,100.95 97.3,104.21 98.01,104.92 103.33,104.92 104.09,104.16 104.09,91.11 105.43,89.77 PROXY2.3
26
  Bottom 0.406: JP6.30 92.26,101.34 92.26,86.36 U$1.26
27
  Bottom 0.406: JP6.29 93.53,99.84 U$1.27
28
  Bottom 0.406: U$1.28 89.72,86.36 89.72,101.34 JP6.28 90.88,106.54 91.27,106.94 100.91,106.94 102.95,108.97 115.3,108.97 ULTRASONIC3.4
29
  Top 0.406: ULTRASONIC3.3 117.35,108.49 102.94,108.49 101.48,107.03 93.72,107.03 92.1,105.4 92.1,101.18 JP6.27
  Bottom 0.406: JP6.27 90.99,99.84 U$1.29
30
  Bottom 0.406: U$1.30 87.18,86.36 87.18,101.34 JP6.26 88.34,107.37 89.44,108.47 100.05,108.47 104.05,112.47 ULTRASONIC1.4
31
  Top 0.406: ULTRASONIC1.3 108.58,111.01 103.8,111.01 100.94,108.15 90.59,108.15 89.6,107.16 89.6,101.22 JP6.25
  Bottom 0.406: JP6.25 88.45,99.84 U$1.31
32
  Bottom 0.406: U$1.32 84.64,86.36 84.64,101.34 JP6.24
33
  Bottom 0.406: JP6.23 85.91,99.84 U$1.33
34
  Bottom 0.406: JP6.22 83.26,101.71 82.1,100.56 82.1,86.36 U$1.34
35
  Bottom 0.406: JP6.21 83.37,99.84 U$1.35
36
  Top 0.406: JP6.20 80.72,106.49 82.25,108.02 82.41,108.18 85.77,111.55 90.05,111.55 94.75,116.24 MOTOR5.2
  Bottom 0.406: JP6.20 79.56,101.34 79.56,86.36 U$1.36
37
  Top 0.406: JP6.19 81.85,101.09 81.85,106.33 86.33,110.81 90.37,110.81 93.26,113.7 MOTOR5.3
  Bottom 0.406: JP6.19 80.83,99.84 U$1.37
38
  Top 0.406: JP6.18 78.18,106.82 87.22,115.86 MOTOR3.2
  Bottom 0.406: JP6.18 78.18,101.65 77.05,100.53 77.05,86.33 U$1.38
39
  Top 0.406: MOTOR3.3 86.71,113.66 79.49,106.44 79.49,101.93 78.18,100.62 JP6.17
  Bottom 0.406: JP6.17 78.29,99.84 U$1.39
40
  Top 0.406: JP6.16 75.64,112.07 MOTOR2.2
  Bottom 0.406: JP6.16 74.48,101.34 74.48,86.36 U$1.40
41
  Top 0.406: MOTOR2.3 78.47,113.76 76.89,112.18 76.89,101.21 JP6.15
  Bottom 0.406: JP6.15 75.75,99.84 U$1.41
42
  Top 0.406: JP6.14 73.1,104.67 70.08,107.69 70.08,114.6 71.76,116.28 MOTOR1.2
  Bottom 0.406: JP6.14 71.94,101.34 71.94,86.77 73.21,85.5 U$1.42
43
  Top 0.406: MOTOR1.3 74.38,111.68 74.38,101.98 73.1,100.7 JP6.13
  Bottom 0.406: JP6.13 73.2,99.85 73.2,88.78 73.21,88.77 U$1.43
44
  Bottom 0.406: JP6.12 69.4,101.34 69.4,86.36 U$1.44
45  (via drill 0.35)
  Top 0.406: v71.49,60.53 71.49,70.69 77.75,76.96 v77.75,77.06 | R48.1 27.28,34.98 28.98,36.67 29.36,36.67 R49.2 29.25,36.77 29.25,41.91 28.33,42.84 25.31,42.84 24.96,43.19 24.96,46.36 25.58,46.97 M4.2
  Bottom 0.406: JP6.11 70.67,99.84 U$1.45 70.67,86.84 71.99,85.52 71.99,84.8 74.32,82.48 74.33,82.48 77.79,79.01 77.79,77.1 v77.75,77.06 | v71.49,60.53 v71.48,60.52 71.48,56.7 54,39.21 33.56,39.21 32.73,40.05 32.73,46.36 32.11,46.97 M4.2
46
  Top 0.406: R36.1 22.08,101.51 23.25,101.51 25.14,103.4 R37.2 25.56,105.07 27.81,107.32 27.81,110.3 27.23,110.87 24.24,110.87 23.58,111.52 23.58,115.04 24.07,115.53 M1.2 27.81,119.87 36.15,128.21 64.78,128.21 66.75,126.24 66.75,103.76 JP6.10
  Bottom 0.406: JP6.10 66.86,101.34 66.86,86.36 U$1.46
47  (via drill 0.35)
  Top 0.406: v56.75,60.54 56.75,60.75 55.78,61.72 38.84,61.72 37.03,59.91 37.03,31.71 35.07,29.75 35.07,24.17 v34.99,24.09 | v60.14,61.27 60.14,61.31 v75.65,76.82 | R52.1 27.02,10.64 28.98,12.61 R53.2 30.2,15.11 25.48,19.83 25.48,22.55 26.05,23.12 M5.2
  Bottom 0.406: JP6.9 68.13,99.84 U$1.47 68.13,86.69 69.44,85.38 69.44,84.3 70.3,83.44 72.02,83.44 75.64,79.82 v75.64,76.83 v75.65,76.82 | v60.14,61.27 60.19,61.22 59.52,60.54 v56.75,60.54 | v34.99,24.09 34.02,23.12 M5.2
48
  Top 0.406: R40.1 31.14,79.51 32.92,81.29 R42.2 33.29,82.28 | 33.29,82.28 32.53,83.04 31.02,83.04 28.54,85.52 24.36,85.52 23.89,86 23.89,89.21 24.56,89.88 M2.2 | 33.29,82.28 33.82,81.76 33.82,122.32 38.46,126.97 64.31,126.97 65.48,125.8 JP6.8
  Bottom 0.406: JP6.8 64.32,101.34 64.32,86.36 U$1.48
49  (via drill 0.35)
  Top 0.406: JP6.7 64.36,101.07 64.36,124.65 63.17,125.84 39.34,125.84 34.88,121.37 34.88,78.18 36.79,76.27 v36.89,76.27 | R44.1 26.29,56.75 28.27,58.73 R45.2 28.92,62.7 27.5,64.13 25.11,64.13 24.73,64.51 24.73,67.68 25.34,68.29 M3.2
  Bottom 0.406: JP6.7 65.59,99.84 U$1.49 | v36.89,76.27 37.33,75.83 37.33,68.68 36.94,68.29 M3.2
50
  Top 0.406: PS2.4 105.2,117.37 97.97,110.14 87.37,110.14 84.48,107.25 84.48,98.84 83.73,98.1 65.19,98.1 64.27,99.01 64.27,100.27 62.94,101.61 JP6.6 | U$1.50 64.83,83.31 67.09,83.31 R5.2
  Bottom 0.406: JP6.6 61.78,101.34 61.78,86.36 U$1.50
51
  Top 0.406: PS2.3 107.74,116.75 100.35,109.36 88.9,109.36 87.08,107.54 87.08,98.43 85.64,96.98 63.96,96.98 62.94,98.01 JP6.5 | U$1.51 64.23,86.45 65.99,86.45 66.8,85.64 66.8,84.35 67.12,84.03 67.68,84.03 67.69,84.03 67.78,84.03 69.27,82.53 71.5,82.53 71.99,82.04 71.99,81.02 R2.2
  Bottom 0.406: JP6.5 63.05,99.84 U$1.51
52
  Top 0.406: U$1.52 61.58,84.02 61.58,81.64 62.28,80.94 R7.2
  Bottom 0.406: U$1.52 59.24,86.36 59.24,101.34 JP6.4 60.4,109.36 62.62,111.58 97.78,111.58 100.12,113.91 PS2.6
53
  Top 0.406: U$1.53 61.76,86.39 61.76,84.86 64.06,82.56 65.33,82.56 66.73,81.16 R6.2
  Bottom 0.406: U$1.53 60.51,99.84 JP6.3 60.4,100.89 61.67,102.17 61.67,108.96 63.35,110.64 98.1,110.64 102.66,115.19 PS2.5
+
  Top 1.524: R43.1 17.49,64.87 OUTPUT3.2 | R39.1 19.03,90.41 OUTPUT2.2 | R47.1 18.56,44.79 OUTPUT4.2 | R51.1 23.95,26.1 18.19,26.1 | 18.19,26.1 OUTPUT5.2 | R55.1 21.13,5.83 16.9,10.06 16.9,24.81 18.19,26.1
  Bottom 1.524: INPUT1.2 7.56,126.14 6.24,124.82 6.24,111.47 7.58,110.12 | OUTPUT1.2 7.58,110.12 | 7.58,110.12 6.16,108.69 6.16,91.91 7.66,90.41 | 7.66,90.41 OUTPUT2.2 | 7.66,90.41 7.66,90.27 6.02,88.63 6.02,66.38 7.53,64.87 | OUTPUT3.2 7.53,64.87 | 7.53,64.87 5.87,63.21 5.87,46.33 7.42,44.79 | OUTPUT4.2 7.42,44.79 | 7.42,44.79 5.87,43.25 5.87,27.74 7.52,26.1 OUTPUT5.2
+5V
  Top 1.016: 114.38,84.13 MPU.5 121.92,84.13 123.7,82.35 123.7,63.06 R13.2 117.68,59.61 116.8,58.74 116.8,53.28 TRANSISTOR1.1 | 114.38,84.13 109.93,84.13 R4.2 | R12.1 R10.1 96.18,76.59 96.18,77.67 94.9,78.96 | R12.1 | R12.1 96.13,73.9 R11.1 | ENCODER2.2 37.31,105.39 | 37.31,105.39 36.12,104.2 36.12,93.54 36.56,93.1 ENCODER3.2 | 37.31,105.39 36.13,106.57 36.13,116.78 37.36,118.01 ENCODER1.2 46.39,118.01 47.64,116.76 47.64,113.09 48.83,111.9 R1.1 55.47,108.91 55.47,108.9 55.47,83.01 59.38,79.1 R31.2 | R29.2 | R31.2 60.44,79.04 R7.1 R6.1 69.46,79.04 R5.1 72.13,78.98 R2.1 94.02,78.92 94.06,78.96 | R8.2 59.21,66.86 R33.2 R29.2 | 59.34,69.53 R30.2 59.34,75.26 | 59.34,69.53 R29.2 | R31.2 59.34,77.94 59.34,75.26 | 59.34,75.26 R32.2 | R26.2 59.34,69.53 | R3.2 94.06,78.96 | 94.06,78.96 94.9,78.96 | 94.9,78.96 109.21,78.96 114.38,84.13
+12V
  Top 1.54: BUCK.IN+ 129.81,27.71 131.97,25.55 131.97,8.97 127.09,4.08 61.34,4.08 56.97,8.45 56.97,35.85 55.99,36.83 U$1.VIN JP2.8
  Bottom 1.524: D6.C 126.07,32.9 127.03,31.94 BUCK.IN+ 129.81,28.31 132.13,25.99 132.13,11.85 133.72,10.26 D1.C
-1
  Bottom 0.813: OUTPUT1.1 20.98,105.12 22.45,106.58 MOSFET1.2
-2
  Bottom 0.813: MOSFET2.2 22.07,81.17 21.52,80.62 12.44,80.62 11.7,81.36 11.7,85.3 OUTPUT2.1
-3
  Bottom 0.813: MOSFET3.2 22.74,56.81 21.83,55.9 12.25,55.9 11.51,56.64 11.51,59.82 OUTPUT3.1
-4
  Bottom 0.813: MOSFET4.2 23.24,37.35 21.73,35.84 12.67,35.84 11.83,36.67 OUTPUT4.1
-5
  Bottom 0.813: OUTPUT5.1 11.39,16.75 12.95,15.18 21.83,15.18 22.27,15.62 MOSFET5.2
A0
  Bottom 0.406: JP1.1 U$1.A0
A1
  Bottom 0.406: U$1.A1 JP1.2
A2
  Bottom 0.406: JP1.3 U$1.A2
A3
  Bottom 0.406: U$1.A3 JP1.4
A4
  Bottom 0.406: JP1.5 U$1.A4
A5
  Bottom 0.406: U$1.A5 JP1.6
A6
  Bottom 0.406: JP1.7 U$1.A6
A7
  Bottom 0.406: U$1.A7 JP1.8
A8
  Bottom 0.406: U$1.A8 JP3.1
A9
  Bottom 0.406: JP3.2 U$1.A9
A10
  Top 0.406: ENCODER1.3 42.37,115.47 46.16,111.68 46.16,102.54 48.09,100.61 48.09,72.71 45.1,69.72 40.32,69.72 JP3.3 | U$1.A10 55.07,67.67 55.07,65.45 55.97,64.56 R8.1
  Bottom 0.406: U$1.A10 JP3.3
A11
  Top 0.406: ENCODER1.4 41.56,112.93 43.95,110.54 43.95,102.98 46.99,99.94 46.99,74.98 44.41,72.39 JP3.4 | U$1.A11 55.76,69.52 55.76,67.81 56.59,66.98 R33.1
  Bottom 0.406: JP3.4 U$1.A11
A12
  Top 0.406: ENCODER2.3 42.66,102.85 46.15,99.35 46.15,75.93 45.16,74.93 JP3.5 | U$1.A12 55.69,72.13 55.69,71.02 57.19,69.52 R29.1
  Bottom 0.406: U$1.A12 JP3.5
A13
  Top 0.406: ENCODER2.4 43.39,100.31 45.25,98.45 45.25,78.22 44.51,77.47 JP3.6 | R30.1 57.42,72.44 56.25,72.44 55.71,72.97 55.71,74.65 U$1.A13
  Bottom 0.406: JP3.6 U$1.A13
A14
  Top 0.406: ENCODER3.3 42.42,90.56 44.08,88.9 44.08,81.43 42.67,80.01 JP3.7 | U$1.A14 55.74,77.17 55.74,75.68 56.17,75.25 R32.1
  Bottom 0.406: U$1.A14 JP3.7
A15
  Top 0.406: ENCODER3.4 41.77,88.02 42.87,86.92 42.87,83.41 42.02,82.55 JP3.8 | U$1.A15 R31.1
  Bottom 0.406: JP3.8 U$1.A15
AREF
  Bottom 0.406: PWMH1.8 U$1.AREF
GND
  Top 0.813: JP6.2 57.86,93.11 | U$1.GND@4 U$1.GND@5 57.83,87.78 57.83,93.07 57.86,93.11 | LASER1.1 109.17,94.72 | 57.86,93.11 58.81,94.06 108.51,94.06 109.17,94.72 | ULTRASONIC1.1 115.16,112.52 115.16,116.19 115.96,116.98 | ULTRASONIC3.1 126.35,116.29 125.66,116.98 115.96,116.98 | 115.96,116.98 115.99,117.01 113.51,119.49 PS2.1 | 109.17,94.72 109.91,93.97 115.2,93.97 115.95,94.72 LASER2.1 | PROXY1.1 124.37,98.33 115.81,89.77 PROXY2.1 | SP3.1 147.09,90.82 147.72,91.44 149.93,91.44 150.58,90.79 150.58,86.02 LED1.C
  Bottom 0.406: PWMH1.7 112.45,17.78 U$1.GND@1
  Bottom 0.813: JP2.6 38.66,31.75 36.18,29.27 36.18,17.44 33.12,14.38 23.63,14.38 15.09,5.84 5.82,5.84 3.11,8.55 S2.1 S2.2 | SP1.1 SP4.1 132.86,77.17 | 132.86,77.17 133.75,76.28 139.14,76.28 139.86,77 SP5.1 139.86,87.17 SP2.1 139.93,90.34 139.93,92.6 | 139.93,92.6 141.01,93.68 146.12,93.68 147.09,92.71 SP3.1 147.01,87.17 SP6.1 147.09,80.02 BUCK.OUT- | 132.86,77.17 132.13,76.45 125.54,76.45 | 125.54,76.45 123.92,74.83 123.92,42.67 121.53,40.27 D3.A 120.88,28.91 118.57,26.6 118.57,19.53 118.6,19.5 116.86,17.77 | JP6.2 JP6.1 | 116.86,17.77 112.46,17.77 112.45,17.78 | 139.93,92.6 138.82,93.7 138.66,93.7 138.65,93.7 116.89,93.7 115.95,94.64 LASER2.1 127.54,99.27 129.48,101.21 129.48,111.2 128.27,112.4 ULTRASONIC3.1 126.35,106.62 PROXY1.1 | 125.54,76.45 120.4,81.59 MPU.4 | PS2.1 112.94,119.61 112.94,123.56 110.23,126.27 51.58,126.27 44.89,119.59 44.89,119.4 | D2.A 117.48,17.77 116.86,17.77 | ENCODER2.1 43.77,107.93 | 43.77,107.93 45.01,106.69 45.01,96.63 44.02,95.64 ENCODER3.1 | 43.77,107.93 43.77,107.95 44.89,109.07 44.89,119.4 | ENCODER1.1 43.74,120.55 44.89,119.4
  Bottom 1.016: U$1.GND@1 76.48,17.78 62.51,31.75 U$1.GND@2
  Bottom 2.54: JP2.6 U$1.GND@2 U$1.GND@3 JP2.7 JP2.6
GND1
  Bottom 1.27: D6.A 131.27,47.76 BUCK.IN- 147.09,12.53 X1.1
GND2
  Top 0.813: MOSFET1.1 19.91,99.54 21.72,97.73 LED22.C 23.13,99.01 23.75,99.62 27.52,99.62 28.64,100.74 LED21.C 30.7,101.38 32.24,99.84 32.24,87.82 31.77,87.34 M2.1 | MOSFET2.1 19.53,80.95 21.28,79.21 26.17,79.21 LED23.C 26.18,77.77 27.42,76.54 31.62,76.54 32.56,75.6 LED24.C 34.51,74.47 35.29,73.69 35.29,66.95 34.09,65.75 | LED30.C 33.93,10.37 LED29.C 35.62,10.57 36.17,11.12 36.17,12.72 29.41,19.48 M5.1 32.82,20.58 33.68,21.44 33.68,29.09 33.27,29.5 LED28.C 31.59,34 LED27.C 33.71,34.8 34.88,35.98 34.88,42.99 33.44,44.43 | M4.1 33.44,44.43 | 33.44,44.43 35,46 35,53.2 34.56,53.65 LED26.C 32.52,56.57 LED25.C 32.81,56.89 34.97,59.05 34.97,64.88 34.09,65.75 | M3.1 34.09,65.75
  Bottom 0.61: INPUT1.1 18.89,121.14 20,120.03 20,114.1 21.11,112.99 21.5,112.99
  Bottom 0.813: MOSFET5.1 19.73,20.15 20.16,20.58 M5.1 | MOSFET3.1 20.2,65.2 20.76,65.75 M3.1 | MOSFET2.1 19.53,85.76 21.14,87.37 28.51,87.37 M2.1 | M1.1 21.5,112.99 20.78,112.99 19.87,112.08 19.87,108.87 MOSFET1.1
  Bottom 1.016: MOSFET4.1 20.7,43.48 21.65,44.43 M4.1
INT0
  Bottom 0.406: PWMH1.10 U$1.INT2
INT1
  Bottom 0.406: U$1.INT1 PWMH1.9
IOREF
  Bottom 0.406: U$1.IOREF JP2.2
N$1
  Top 1.016: LED1.A 150.53,79.97 R9.2
N$3
  Bottom 1.524: X1.2 140.99,19 139.79,20.19 135.74,20.19 134.7,19.15 D1.A
N$8
  Top 0.406: PROXY1.2 121.83,97.65 117.06,92.88 111.36,92.88 110.8,92.32 PROXY2.2 110.8,89.07 107.91,86.18 R4.1
N$9  (via drill 0.35)
  Top 0.406: D2.C 124.12,6.29 125.78,7.95 R25.1 125.4,20.12 TRANSISTOR.2 | v123,35.24 123,49.82 122.38,50.43 D3.C 120.74,50.57 120.6,50.72 | TRANSISTOR1.2 120.6,50.72 | 120.6,50.72 120.25,51.06 R13.1
  Bottom 0.406: v123,35.24 123,28.77 125.41,26.36 125.41,24.29 TRANSISTOR.2
N$27  (via drill 0.35)
  Top 0.406: v109.06,80.6 93.79,80.6 R3.1 | ULTRASONIC3.2 126.9,109.31 126.9,98.44 v120.15,91.69
  Bottom 0.406: ULTRASONIC1.2 112.58,115.26 113.12,115.8 123.42,115.8 123.78,115.43 123.78,112.43 ULTRASONIC3.2 | v109.06,80.6 v120.15,91.69
N$28  (via drill 0.35)
  Top 0.406: R1.2 55.44,113.84 55.44,117.67 58.59,120.82 61.1,120.82 v61.12,120.8 | v69.12,120.76 69.52,120.76 71.39,122.62 109.8,122.62 110.28,122.15 PS2.2
  Bottom 0.406: v69.12,120.76 69.06,120.82 61.14,120.82 v61.12,120.8
N$41
  Top 0.406: R36.2 22.03,104.72 23.11,105.8 24.83,105.8 24.99,105.96 MOSFET1.3
N$42
  Top 0.406: LED21.A 28.64,103.42 27.92,103.42 27.47,102.97 27.47,102.06 26.91,101.5 R37.1
N$43
  Top 0.406: LED22.A 26.21,96.75 R38.1
N$44
  Top 0.406: R39.2 22.6,95.33 24.42,93.51 R38.2
N$45
  Top 0.406: MOSFET2.3 29.08,83.73 29.5,83.31 R40.2
N$46
  Top 0.406: LED23.A 27.24,81.32 27.73,80.83 27.73,78.02 28.01,77.74 33.02,77.74 33.29,78.02 R42.1
N$47
  Top 0.406: R41.2 29.01,74.7 R43.2
N$48
  Top 0.406: LED24.A 29.44,72.37 R41.1
N$49
  Top 0.406: MOSFET3.3 25.28,58.73 R44.2
N$50
  Top 0.406: LED25.A 30.03,56.83 R45.1
N$51
  Top 0.406: R46.1 32.49,51.51 LED26.A
N$52
  Top 0.406: R47.2 28.9,53.41 R46.2
N$53
  Top 0.406: MOSFET4.3 25.78,36.99 R48.2
N$54
  Top 0.406: R49.1 29.99,34.75 32.15,36.9 LED27.A
N$55
  Top 0.406: R50.1 31.24,27.75 LED28.A
N$56
  Top 0.406: R51.2 28.79,29.68 R50.2
N$57
  Top 0.406: R53.1 30.21,10.72 31.77,10.72 LED29.A
N$58
  Top 0.406: MOSFET5.3 24.81,14.17 R52.2
N$59
  Top 0.406: R55.2 26.16,7.79 R54.2
N$60
  Top 0.406: R54.1 33.89,5.89 LED30.A
NC
  Bottom 0.406: JP2.1 U$1.NC
OP1  (via drill 0.35)
  Top 1.016: 130.32,72.07 SP4.2 SP1.2 130.32,90.95 130.92,91.55 136.79,91.55 137.41,90.93 137.41,87.26 SP2.2 137.39,80.33 SP5.2 137.32,76.44 138.03,75.73 143.78,75.73 144.55,76.5 | 130.32,72.07 BUCK.OUT+ | SP3.2 144.55,80.17 | 144.55,80.17 SP6.2 | 144.55,80.17 144.55,76.5 | 144.55,76.5 145.26,75.79 150.14,75.79 150.47,76.13 R9.1 | v122.22,54.76 126.62,54.76 130.32,58.46 130.32,72.07 | TRANSISTOR1.3 116.83,39.15 127.95,28.03 TRANSISTOR.1 127.94,19.99 R25.2
  Bottom 1.016: TRANSISTOR1.3 118.77,48.18 119.17,48.58 119.17,53.47 120.46,54.76 v122.22,54.76
RESET  (via drill 0.35)
  Top 0.406: R26.1 64.69,67.34 58.99,61.64 58.99,31.47 72.78,17.67 v72.78,12.75
  Top 1.016: S2.3 8.83,9.57 14.57,3.83 35.76,3.83 37.46,5.53 37.46,22.64 38.95,24.13 JP2.3
  Bottom 0.406: JP2.3 U$1.RESET 52.92,24.16 55.58,24.16 67.77,11.97 72,11.97 v72.78,12.75
  Bottom 0.813: S2.4 S2.3
VCC
  Bottom 1.016: JP2.5 U$1.5V 57.15,29.21 70.68,15.69 78.9,15.69 91.01,3.58 119.87,3.58 122.86,6.57 TRANSISTOR.3
VCC1
  Bottom 1.016: JP6.36 JP6.35 101.04,87.75 U$1.5V@1 U$1.5V@2
(copper drawn outside any net)
  shapes: Top area x2

### Text on the board
tNames: ENCODER1 | PS | (52,53,50,51,N$28,GND) | MOTOR1 | MOTOR2 | MOTOR3 | MOTOR4 | (A11,A10) | TEAM / VULCANS / 2K20 | (30,31) | ULTRA | (28,29) | ULTRA | (43.42,10) | (41,40,11) | (39,38,12) | (37,36,13) | ENCODER2 | PROXY 1(24) | LASER2 | LASER1 | (A13,A12) | ENCODER3 | (22,GND) | (23,GND) | PROXY 2(25) | (A15,A14) | (19,20,21,GND,5V) | (C,B,E)